# Altium schematic sheet temps.SchDoc: Temperatures
size A; Organization: Cal Poly Racing; engineer1: Graydon Wilson; engineer2: Jason Childers; engineer3: Haley Pierce
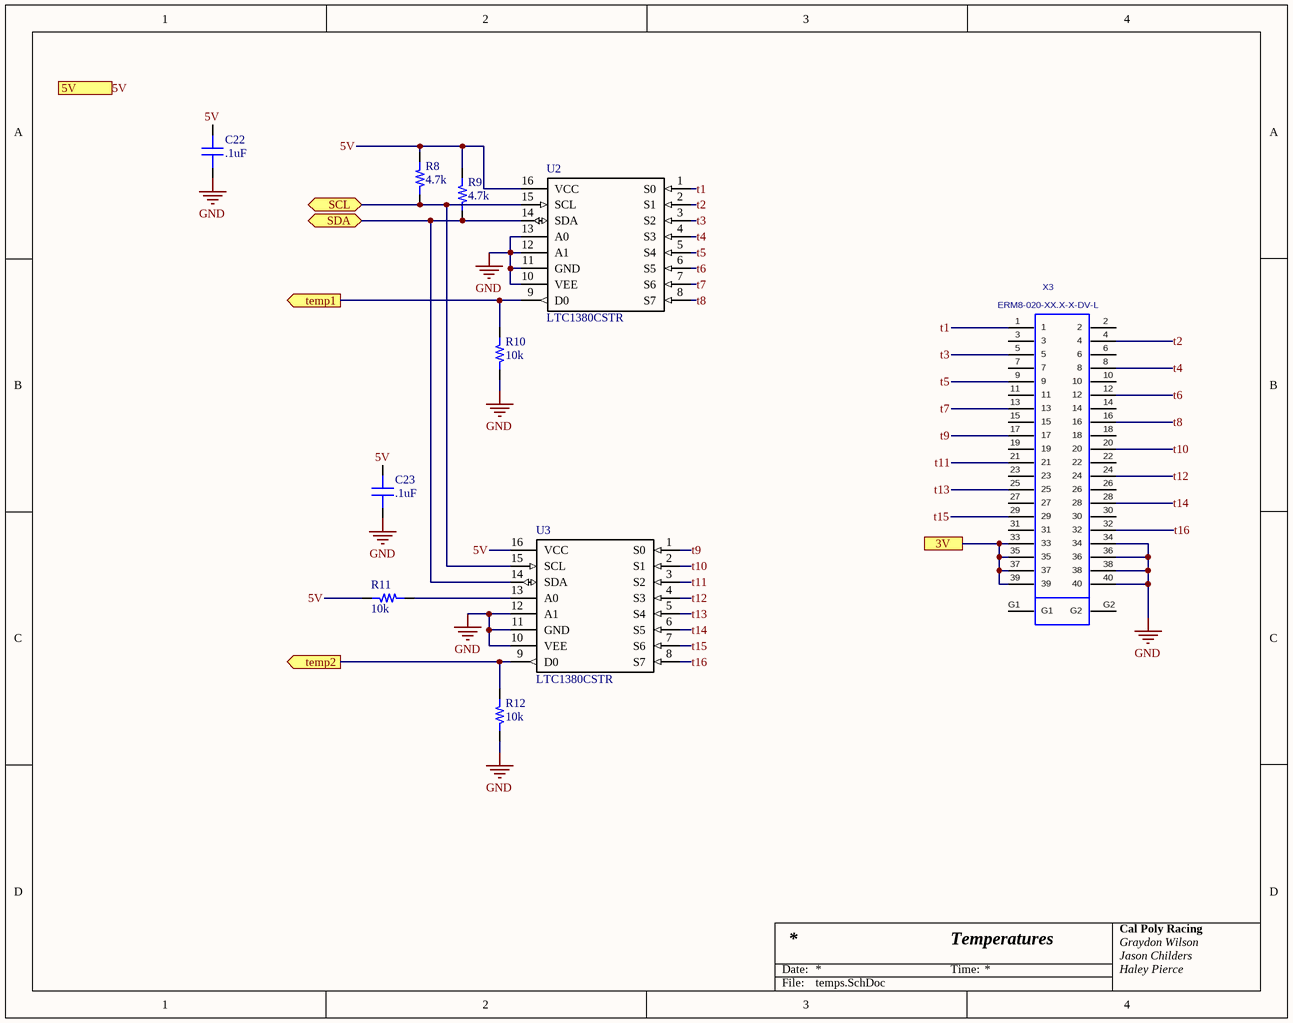
[diagram p0: temps.SchDoc]

## Parts
C22  capacitance: .1uF  [0603]  (hidden comment: capacitor)
C23  capacitance: .1uF  [0603]  (hidden comment: capacitor)
R8  4.7k  [RES 0603/1608]
R9  4.7k  [RES 0603/1608]
R10  10k  [RES 0603/1608]
R11  10k  [RES 0603/1608]
R12  10k  [RES 0603/1608]
U2  LTC1380CSTR  [LTC1380CSTR]
U3  LTC1380CSTR  [LTC1380CSTR]
X3  ERM8-020-XX.X-X-DV-L  [ERM8-020-XX.X-X-DV-L]

## Ports
3V, 5V, SCL (bidir), SDA (bidir), temp1 (out), temp2 (out)

## Nets
GND: C22.1 C23.1 R10.1 R12.1 U2.10(VEE) U2.11(GND) U2.12(A1) U2.13(A0) U3.10(VEE) U3.11(GND) U3.12(A1) X3.34 X3.36 X3.38 X3.40
3V: X3.33 X3.35 X3.37 X3.39 ; port 3V
5V: C22.2 C23.2 R8.2 R9.2 R11.2 U2.16(VCC) U3.16(VCC) ; port 5V
SCL: R8.1 U2.15(SCL) U3.15(SCL) ; port SCL
SDA: R9.1 U2.14(SDA) U3.14(SDA) ; port SDA
t1: U2.1(S0) X3.1
t2: U2.2(S1) X3.4
t3: U2.3(S2) X3.5
t4: U2.4(S3) X3.8
t5: U2.5(S4) X3.9
t6: U2.6(S5) X3.12
t7: U2.7(S6) X3.13
t8: U2.8(S7) X3.16
t9: U3.1(S0) X3.17
t10: U3.2(S1) X3.20
t11: U3.3(S2) X3.21
t12: U3.4(S3) X3.24
t13: U3.5(S4) X3.25
t14: U3.6(S5) X3.28
t15: U3.7(S6) X3.29
t16: U3.8(S7) X3.32
temp1: R10.2 U2.9(D0) ; port temp1
temp2: R12.2 U3.9(D0) ; port temp2
NetR11_1: R11.1 U3.13(A0)

Not connected (* = marked no-connect by the designer): X3 2 3 6 7 10 11 14 15 18 19 22 23 26 27 30 31 G1 G2

## Notes on the sheet
- Date:
- Time:
- File:

## Library data of the parts
C22 C23 = 1: Generic 0603 capacitor; id: 1; voltage: 50; dielectric: Ceramic; percent tolerance: 10; name: 0603 Capacitor; ESR: 1; package: 0603; quantity: 0
R8-R12 = 1: id: 1; name: 0603 Resistor; percent tolerance: 5; package: 0603; quantity: 0
  R8 R9: resistance: 4.7k
  R10-R12: resistance: 10k
U2 U3 = 39: 8:1 analog multiplexer. I2C interface. 2 address pins.; id: 39; vcc: 5; updatedby: 0; name: LTC1380; voltageinmax: 5; package: SOIC-16; quantity: 0; link: https://www.mouser.com/ProductDetail/Analog-Devices-Linear-Technology/LTC1380CSTR?qs=hVkxg5c3xu%2Flgahs8%252BvvEA%3D%3D; createdby: Haley Pierce
X3 = 34: MANUFACTURER: SAMTEC; id: 34; numcontacts: 40; numrows: 2; CREATED: August 17, 2016 - Wendy Xin; PCB DECAL: ERM8-020-XX.X-X-DV-L; name: ERM8-020-XX.X-X-DV-L; quantity: 0